# EAGLE design BikeLight_r10 (EAGLE 6.4)
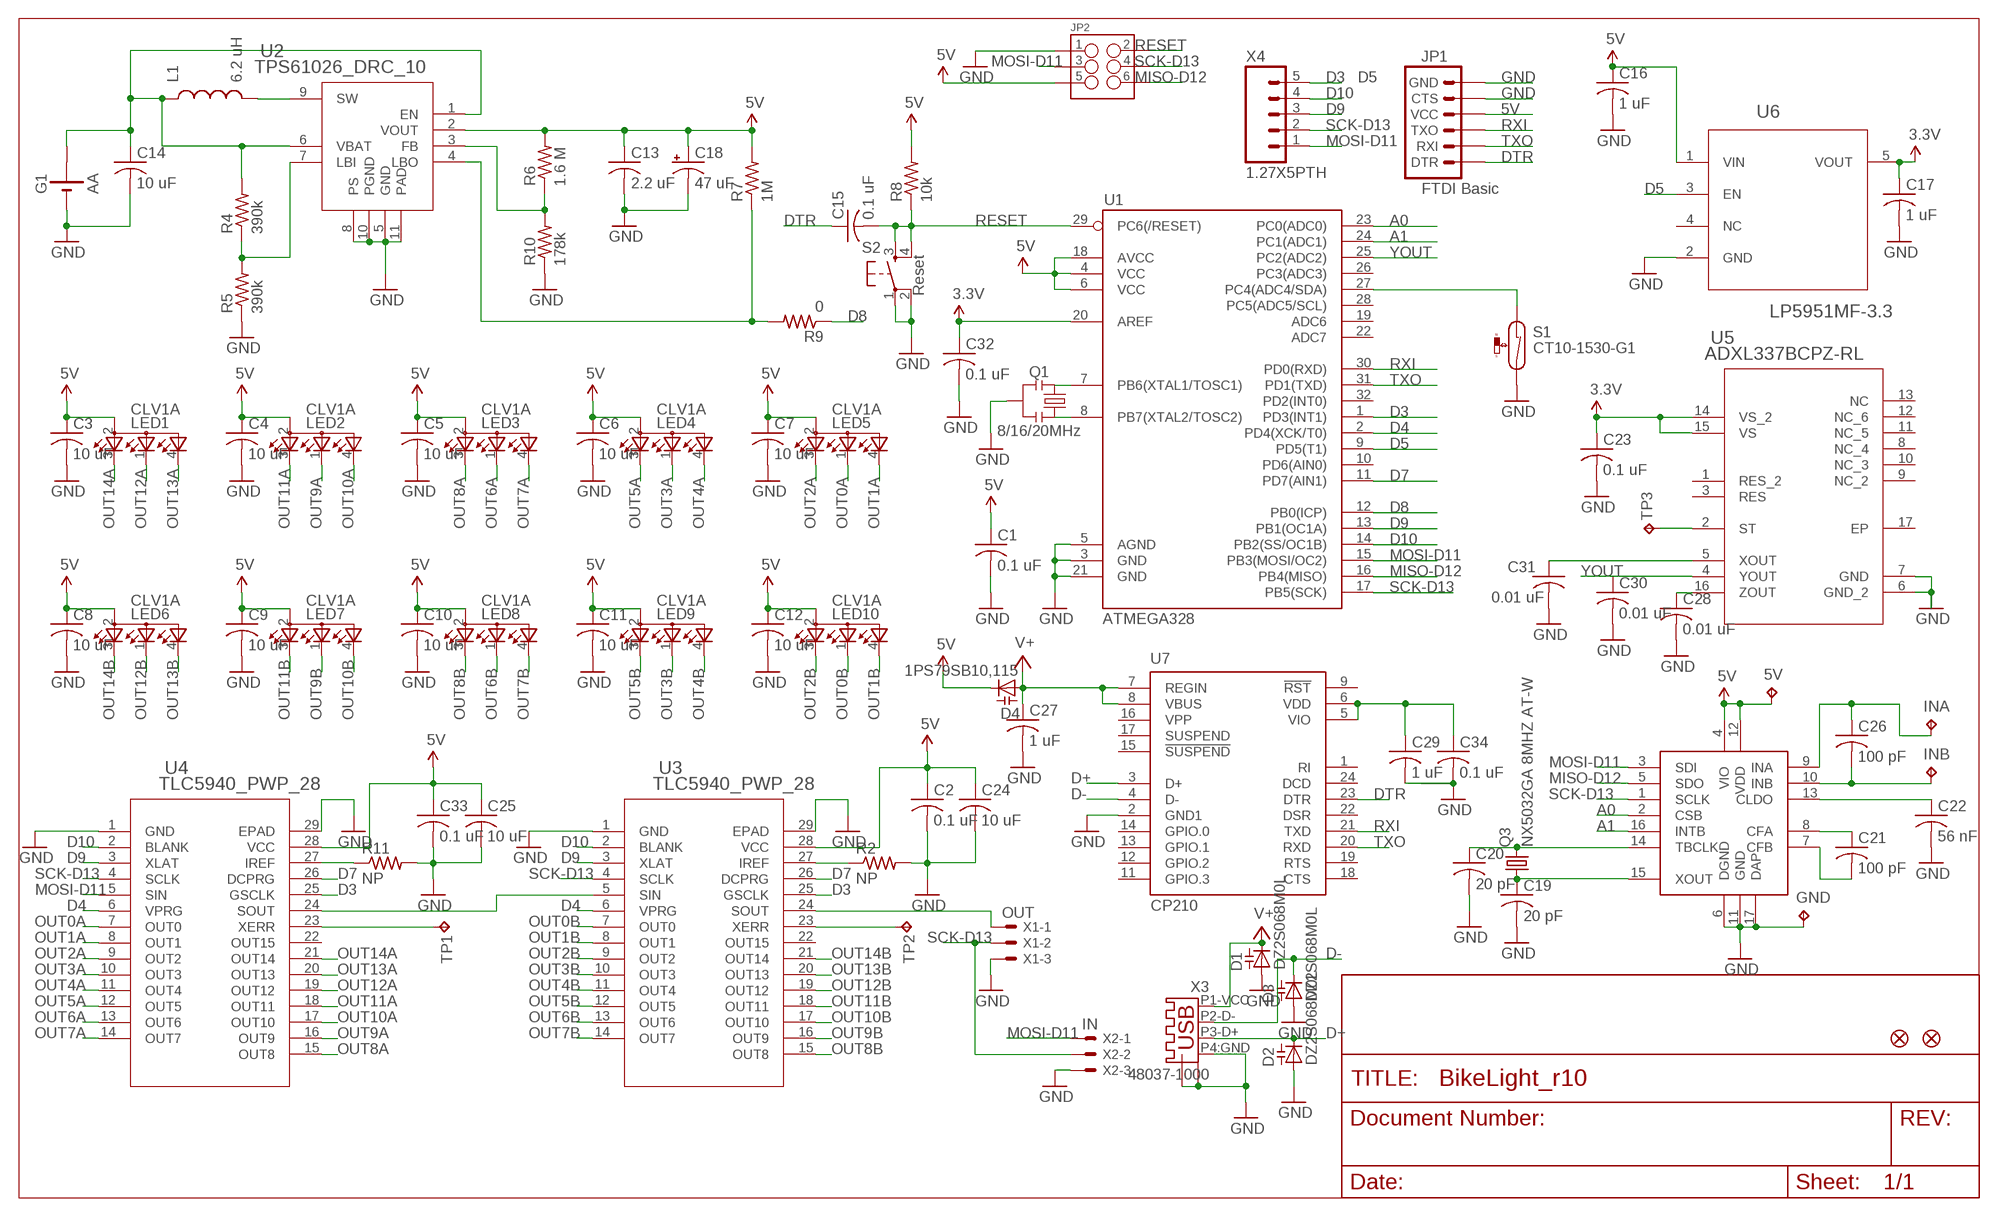
[diagram p0: schematic, sheet 1]

## Parts
5V  TPPAD1-13  [P1-13]
C1  0.1 uF  C-USC0402  [C0402]
C2  0.1 uF  C-USC0402  [C0402]
C3  10 uF  C-USC0805  [C0805]
C4  10 uF  C-USC0805  [C0805]
C5  10 uF  C-USC0805  [C0805]
C6  10 uF  C-USC0805  [C0805]
C7  10 uF  C-USC0805  [C0805]
C8  10 uF  C-USC0805  [C0805]
C9  10 uF  C-USC0805  [C0805]
C10  10 uF  C-USC0805  [C0805]
C11  10 uF  C-USC0805  [C0805]
C12  10 uF  C-USC0805  [C0805]
C13  2.2 uF  C-USC0805K  [C0805K]
C14  10 uF  C-USC0805K  [C0805K]
C15  0.1 uF  C-USC0402  [C0402]
C16  1 uF  C-USC0402  [C0402]
C17  1 uF  C-USC0402  [C0402]
C18  47 uF  CPOL-USCT6032  [CT6032]
C19  20 pF  C-USC0402  [C0402]
C20  20 pF  C-USC0402  [C0402]
C21  100 pF  C-USC0805K  [C0805K]
C22  56 nF  C-USC0402  [C0402]
C23  0.1 uF  C-USC0402  [C0402]
C24  10 uF  C-USC0805K  [C0805K]
C25  10 uF  C-USC0805K  [C0805K]
C26  100 pF  C-USC0805K  [C0805K]
C27  1 uF  C-USC0402  [C0402]
C28  0.01 uF  C-USC0402  [C0402]
C29  1 uF  C-USC0402  [C0402]
C30  0.01 uF  C-USC0402  [C0402]
C31  0.01 uF  C-USC0402  [C0402]
C32  0.1 uF  C-USC0402  [C0402]
C33  0.1 uF  C-USC0402  [C0402]
C34  0.1 uF  C-USC0402  [C0402]
D1  DZ2S068M0L  BB141  [SOD523]
D2  DZ2S068M0L  BB141  [SOD523]
D3  DZ2S068M0L  BB141  [SOD523]
D4  1PS79SB10,115  BB141  [SOD523]
G1  AA  [AA_BATTERY]
GND  TPPAD1-13  [P1-13]
INA  TPPAD1-13  [P1-13]
INB  TPPAD1-13  [P1-13]
JP1  FTDI Basic  ARDUINO_SERIAL_PROGRAMPTH  [1X06]
JP2  M03X2POGO_PINS  [2X3_POGO]
L1  6.2 uH  INDUCTORSRU1038  [CDRH52D]
LED1  CLV1A  TOPLED-3  [P-LCC-4-3]
LED2  CLV1A  TOPLED-3  [P-LCC-4-3]
LED3  CLV1A  TOPLED-3  [P-LCC-4-3]
LED4  CLV1A  TOPLED-3  [P-LCC-4-3]
LED5  CLV1A  TOPLED-3  [P-LCC-4-3]
LED6  CLV1A  TOPLED-3  [P-LCC-4-3]
LED7  CLV1A  TOPLED-3  [P-LCC-4-3]
LED8  CLV1A  TOPLED-3  [P-LCC-4-3]
LED9  CLV1A  TOPLED-3  [P-LCC-4-3]
LED10  CLV1A  TOPLED-3  [P-LCC-4-3]
Q1  8/16/20MHz  RESONATORSMD  [RESONATOR-SMD]
Q3  NX5032GA 8MHZ AT-W  FC-12M  [FC-12M]
R2  NP  R-US_R0402  [R0402]
R4  390k  R-US_R0402  [R0402]
R5  390k  R-US_R0402  [R0402]
R6  1.6 M  R-US_R0805  [R0805]
R7  1M  R-US_R0805  [R0805]
R8  10k  R-US_R0402  [R0402]
R9  0  R-US_R0805  [R0805]
R10  178k  R-US_R0805  [R0805]
R11  NP  R-US_R0402  [R0402]
S1  CT10-1530-G1  REED-SWITCH-CT10-1530-G1  [CT10-G1]
S2  Reset  TAC_SWITCHSMD  [TACTILE_SWITCH_SMD]
TP1  TPB1,27  [B1,27]
TP2  TPB1,27  [B1,27]
TP3  TPB1,27  [B1,27]
U1  ATMEGA328  ATMEGA168  [TQFP32-08]
U2  TPS61026_DRC_10  [DRC10_2P4X1P65]
U3  TLC5940_PWP_28  [PWP28_6P17X2P4]
U4  TLC5940_PWP_28  [PWP28_6P17X2P4]
U5  ADXL337BCPZ-RL  [CP_16_28]
U6  LP5951MF-3.3  [SOT95P285X120-5N]
U7  CP210  [QFN24-4X4]
U8  LDC1000  [WSON-16]
U$2  FIDUCIAL1X2  [FIDUCIAL-1X2]
U$4  FIDUCIAL1X2  [FIDUCIAL-1X2]
X1  OUT  22-23-2031  [22-23-2031]
X2  IN  22-23-2031  [22-23-2031]
X3  48037-1000  USB-A003  [USB-A_PLUG]
X4  1.27X5PTH  [1X04-1.27MM]

## Nets
3.3V: C17.1 C23.1 C32.1 U1.20(AREF) U5.14(VS_2) U5.15(VS) U6.5(VOUT)
5V: 5V.TP C1.1 C2.1 C3.1 C4.1 C5.1 C6.1 C7.1 C8.1 C9.1 C10.1 C11.1 C12.1 C13.1 C16.1 C18.+ C24.1 C25.1 C33.1 D4.C JP1.4(VCC) JP2.P$5 LED1.2(A2) LED2.2(A2) LED3.2(A2) LED4.2(A2) LED5.2(A2) LED6.2(A2) LED7.2(A2) LED8.2(A2) LED9.2(A2) LED10.2(A2) R6.2 R7.2 R8.2 U1.4(VCC) U1.6(VCC) U1.18(AVCC) U2.2(VOUT) U3.28(VCC) U4.28(VCC) U6.1(VIN) U8.4(VIO) U8.12(VDD)
A0: U1.23(PC0(ADC0)) U8.2(CSB)
A1: U1.24(PC1(ADC1)) U8.16(INTB)
D3: U1.1(PD3(INT1)) U3.25(GSCLK) U4.25(GSCLK) X4.5
D4: U1.2(PD4(XCK/T0)) U3.6(VPRG) U4.6(VPRG)
D5: U1.9(PD5(T1)) U6.3(EN)
D7: U1.11(PD7(AIN1)) U3.26(DCPRG) U4.26(DCPRG)
D8: R9.1 U1.12(PB0(ICP))
D9: U1.13(PB1(OC1A)) U3.3(XLAT) U4.3(XLAT) X4.3
D10: U1.14(PB2(SS/OC1B)) U3.2(BLANK) U4.2(BLANK) X4.4
D+: D2.C U7.3(D+) X3.P3-D+
D-: D3.C U7.4(D-) X3.P2-D-
DTR: C15.1 JP1.1(DTR) U7.23(DTR)
GND [vcc]: C1.2 C2.2 C3.2 C4.2 C5.2 C6.2 C7.2 C8.2 C9.2 C10.2 C11.2 C12.2 C13.2 C14.2 C16.2 C17.2 C18.- C19.2 C20.2 C22.2 C23.2 C24.2 C25.2 C27.2 C28.2 C29.2 C30.2 C31.2 C32.2 C33.2 C34.2 D1.A D2.A D3.A G1.P$2-(-) GND.TP JP1.5(CTS) JP1.6(GND) JP2.P$1 Q1.2 R2.2 R5.1 R10.1 R11.2 S1.2 S2.1 S2.2 U1.3(GND) U1.5(AGND) U1.21(GND) U2.5(GND) U2.8(PS) U2.10(PGND) U2.11(PAD) U3.1(GND) U3.29(EPAD) U4.1(GND) U4.29(EPAD) U5.6(GND_2) U5.7(GND) U6.2(GND) U7.2(GND1) U8.6(DGND) U8.11(GND) U8.17(DAP) X1.3 X2.3 X3.P4:GND X3.P$5(SHLD1) X3.P$6(SHLD2)
MISO-D12: JP2.P$6 U1.16(PB4(MISO)) U8.5(SDO)
MOSI-D11: JP2.P$3 U1.15(PB3(MOSI/OC2)) U4.5(SIN) U8.3(SDI) X2.1 X4.1
N$1: Q1.1 U1.8(PB7(XTAL2/TOSC2))
N$2: Q1.3 U1.7(PB6(XTAL1/TOSC1))
N$3: U3.5(SIN) U4.24(SOUT)
N$4: U3.24(SOUT) X1.1
N$5: TP1.TP U4.23(XERR)
N$6: TP2.TP U3.23(XERR)
N$7: R4.1 R5.2 U2.7(LBI)
N$8: R6.1 R10.2 U2.3(FB)
N$9: R2.1 U3.27(IREF)
N$10: C14.1 G1.P$1+(+) L1.1 R4.2 U2.1(EN) U2.6(VBAT)
N$11: L1.2 U2.9(SW)
N$12: R7.1 R9.2 U2.4(LBO)
N$13: TP3.TP U5.2(ST)
N$14: C20.1 Q3.2 U8.14(TBCLK)
N$15: C19.1 Q3.1 U8.15(XOUT)
N$16: R11.1 U4.27(IREF)
N$17: C21.1 U8.8(CFA)
N$18: C21.2 U8.7(CFB)
N$19: C26.2 INB.TP U8.10(INB)
N$20: C22.1 U8.13(CLDO)
N$21: C29.1 C34.1 U7.5(VIO) U7.6(VDD)
N$22: C26.1 INA.TP U8.9(INA)
N$23: C31.1 U5.5(XOUT)
N$25: S1.1 U1.27(PC4(ADC4/SDA))
OUT0A: LED5.1(CBLUE) U4.7(OUT0)
OUT0B: LED10.1(CBLUE) U3.7(OUT0)
OUT1A: LED5.4(CGREEN) U4.8(OUT1)
OUT1B: LED10.4(CGREEN) U3.8(OUT1)
OUT2A: LED5.3(CRED) U4.9(OUT2)
OUT2B: LED10.3(CRED) U3.9(OUT2)
OUT3A: LED4.1(CBLUE) U4.10(OUT3)
OUT3B: LED9.1(CBLUE) U3.10(OUT3)
OUT4A: LED4.4(CGREEN) U4.11(OUT4)
OUT4B: LED9.4(CGREEN) U3.11(OUT4)
OUT5A: LED4.3(CRED) U4.12(OUT5)
OUT5B: LED9.3(CRED) U3.12(OUT5)
OUT6A: LED3.1(CBLUE) U4.13(OUT6)
OUT6B: LED8.1(CBLUE) U3.13(OUT6)
OUT7A: LED3.4(CGREEN) U4.14(OUT7)
OUT7B: LED8.4(CGREEN) U3.14(OUT7)
OUT8A: LED3.3(CRED) U4.15(OUT8)
OUT8B: LED8.3(CRED) U3.15(OUT8)
OUT9A: LED2.1(CBLUE) U4.16(OUT9)
OUT9B: LED7.1(CBLUE) U3.16(OUT9)
OUT10A: LED2.4(CGREEN) U4.17(OUT10)
OUT10B: LED7.4(CGREEN) U3.17(OUT10)
OUT11A: LED2.3(CRED) U4.18(OUT11)
OUT11B: LED7.3(CRED) U3.18(OUT11)
OUT12A: LED1.1(CBLUE) U4.19(OUT12)
OUT12B: LED6.1(CBLUE) U3.19(OUT12)
OUT13A: LED1.4(CGREEN) U4.20(OUT13)
OUT13B: LED6.4(CGREEN) U3.20(OUT13)
OUT14A: LED1.3(CRED) U4.21(OUT14)
OUT14B: LED6.3(CRED) U3.21(OUT14)
RESET: C15.2 JP2.P$2 R8.1 S2.3 S2.4 U1.29(PC6(/RESET))
RXI: JP1.3(TXO) U1.30(PD0(RXD)) U7.21(TXD)
SCK-D13: JP2.P$4 U1.17(PB5(SCK)) U3.4(SCLK) U4.4(SCLK) U8.1(SCLK) X1.2 X2.2 X4.2
TXO: JP1.2(RXI) U1.31(PD1(TXD)) U7.20(RXD)
V+: C27.1 D1.C D4.A U7.7(REGIN) U7.8(VBUS) X3.P1-VCC
YOUT: C30.1 U1.25(PC2(ADC2)) U5.4(YOUT)
ZOUT: C28.1 U5.16(ZOUT)
Unconnected: U1.10(PD6(AIN0)) U1.19(ADC6) U1.22(ADC7) U1.26(PC3(ADC3)) U1.28(PC5(ADC5/SCL)) U1.32(PD2(INT0)) U3.22(OUT15) U4.22(OUT15) U5.1(RES_2) U5.3(RES) U5.8(NC_4) U5.9(NC_2) U5.10(NC_3) U5.11(NC_5) U5.12(NC_6) U5.13(NC) U5.17(EP) U6.4(NC) U7.1(RI) U7.9(!RST) U7.11(GPIO.3) U7.12(GPIO.2) U7.13(GPIO.1) U7.14(GPIO.0) U7.15(!SUSPEND) U7.16(VPP) U7.17(SUSPEND) U7.18(CTS) U7.19(RTS) U7.22(DSR) U7.24(DCD)

## Library data of the parts
5V GND INA INB TP1-TP3 = testpad:TP: Test pad
C1-C17 C19-C34 = resistor:C-US: CAPACITOR, American symbol
C18 = resistor:CPOL-US: POLARIZED CAPACITOR, American symbol
D1-D4 = diode:BB141: Capacity DIODE variable-capacitance diode
G1 = POV_light:AA: AA battery
JP1 = SparkFun:ARDUINO_SERIAL_PROGRAM
JP2 = 1.27mmx5 PTH:M03X2: 2x3 .1" header. Shrouded, with keying- CONN-10681 SMT- CONN-11415 Pogo pins- HW-11044; PROD_ID: HW-11044
L1 = Inductor-SumidaCDRH5D28:INDUCTOR: Inductors Basic Inductor/Choke - 0603 and 1206. Footprints are not proven and vary greatly between part numbers.
LED1-LED10 = ledengin:TOPLED-3: OSRAM - Hyper Multi TOPLED® (RGB) LB E673, LV E673, LT E673 - Power TOPLED® Enhanced optical Power LED (HOP2000) LS E67B, LA E67B, LO E67B, LY E67B - Hyper Multi TOPLED® Enhanced optical Power LED (HOP2000 / ATON®) LATB T66B - Hyper Multi TOPLED® Hyper-Bright LED LATB T686 Source: http://www.osram.convergy.de/
Q1 = SparkFun:RESONATOR: Resonator Small SMD resonator. This is the itty bitty 10/20MHz resonators with built in caps. CSTCE10M0G55 and CSTCE20M0V53. Footprint has been reviewed closely but hasn't been tested yet.
Q3 = crystal:FC-12M: kHz RANGE CRYSTAL UNIT LOW PROFILE SMD Source: Epson Toyocom FC-12M.pdf
R2 R4-R9 R11 = resistor:R-US_: RESISTOR, American symbol
R10 = adafruit:R-US_: RESISTOR, American symbol
S1 = switch-reed:REED-SWITCH-: Reed Sensor; MF: COTO TECHNOLOGY; MPN: CT10-1530-G1; OC_FARNELL: 1081696
S2 = SparkFun:TAC_SWITCH: Momentary Switch Button commonly used for reset or general input. Spark Fun Electronics SKU : COM-00097
U1 = SparkFun:ATMEGA168
U2 = TPS61026:TPS61026_DRC_10; DATASHEETURL: http://www.ti.com/lit/gpn/TPS61026; DESCRIPTION: 5.0-V Output, 1.8-A Switch, 96% Efficient Boost Converter w/ LDO Down-Mode, QFN-10; FAMILY_NAME: STEP-UP REGULATOR; GENERIC_PART_NUMBER: TPS61026; INDUSTRY_STD_PKG_TYPE: SON; MANUFACTURER: Texas Instruments; MANUFACTURER_PART_NUMBER: tps61026_drc_10; PACKAGE_DESIGNATOR: DRC; PIN_COUNT: 10; VENDOR: Texas Instruments
U3 U4 = TI:TLC5940_PWP_28; DATASHEETURL: http://www.ti.com/lit/gpn/TLC5940; DESCRIPTION: 16-Channel LED Driver w/EEprom DOT Correction & Grayscale PWM Control; FAMILY_NAME: LED DRIVER; GENERIC_PART_NUMBER: TLC5940; INDUSTRY_STD_PKG_TYPE: HTSSOP; MANUFACTURER: Texas Instruments; MANUFACTURER_PART_NUMBER: tlc5940_pwp_28; PACKAGE_DESIGNATOR: PWP; PIN_COUNT: 28; VENDOR: Texas Instruments
U5 = ADXL337:ADXL337BCPZ-RL
U6 = LP5951:LP5951MF-3.3: Low-Dropout CMOS Voltage Regulator; MPN: LP5951MF-33; OC_FARNELL: 1312658; OC_NEWARK: 13M2085; PACKAGE: SOT-23-5; SUPPLIER: National Semiconductors
U7 = POV_light:CP210*: Single-Chip USB to UART Bridge Source: www.silabs.com .. CP2101.pdf / cp2102.pdf
U8 = LDC1000:LDC1000
U$2 U$4 = SparkFun:FIDUCIAL: Fiducial Alignment Points Various fiducial points for machine vision alignment.
X1 X2 = con-molex:22-23-2031: .100" (2.54mm) Center Header - 3 Pin; MF: MOLEX; MPN: 22-23-2031; OC_FARNELL: 1462950; OC_NEWARK: 30C0862
X3 = POV_light:USB-A003: USB connector
X4 = 1.27mmx5 PTH:1.27X5PTH

## Net classes
0 default: width 0.203 mm
1 vcc: width 0.254 mm

## Board
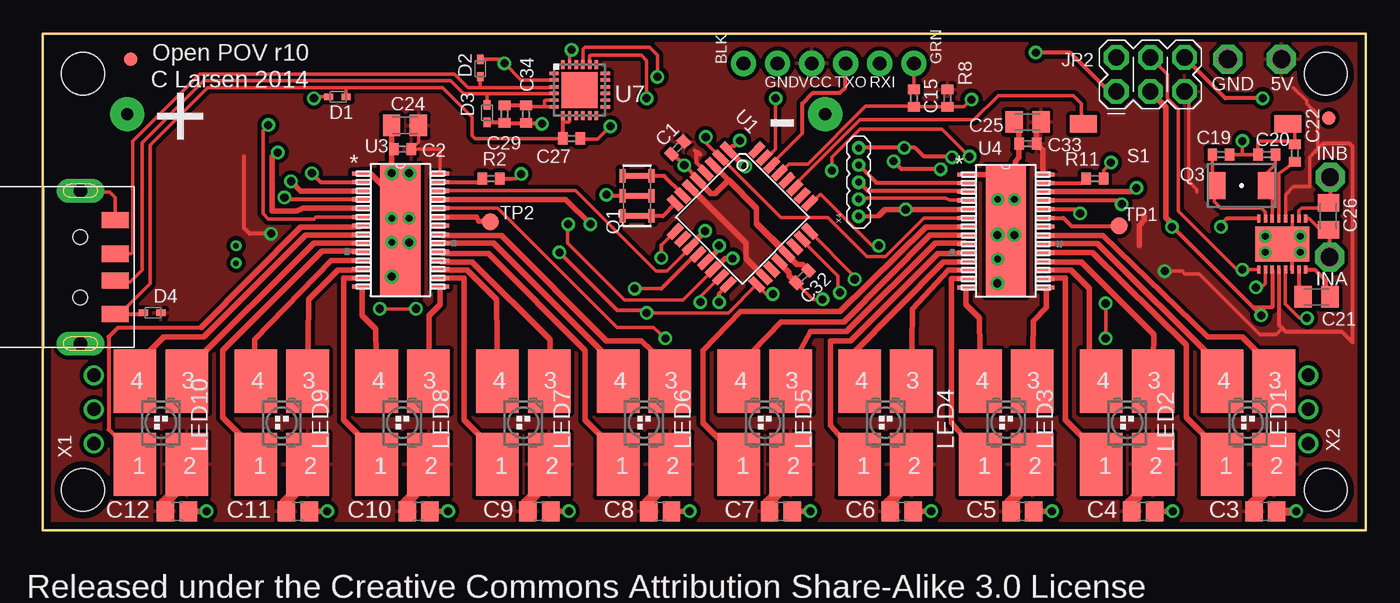
[diagram p1: board, top side]
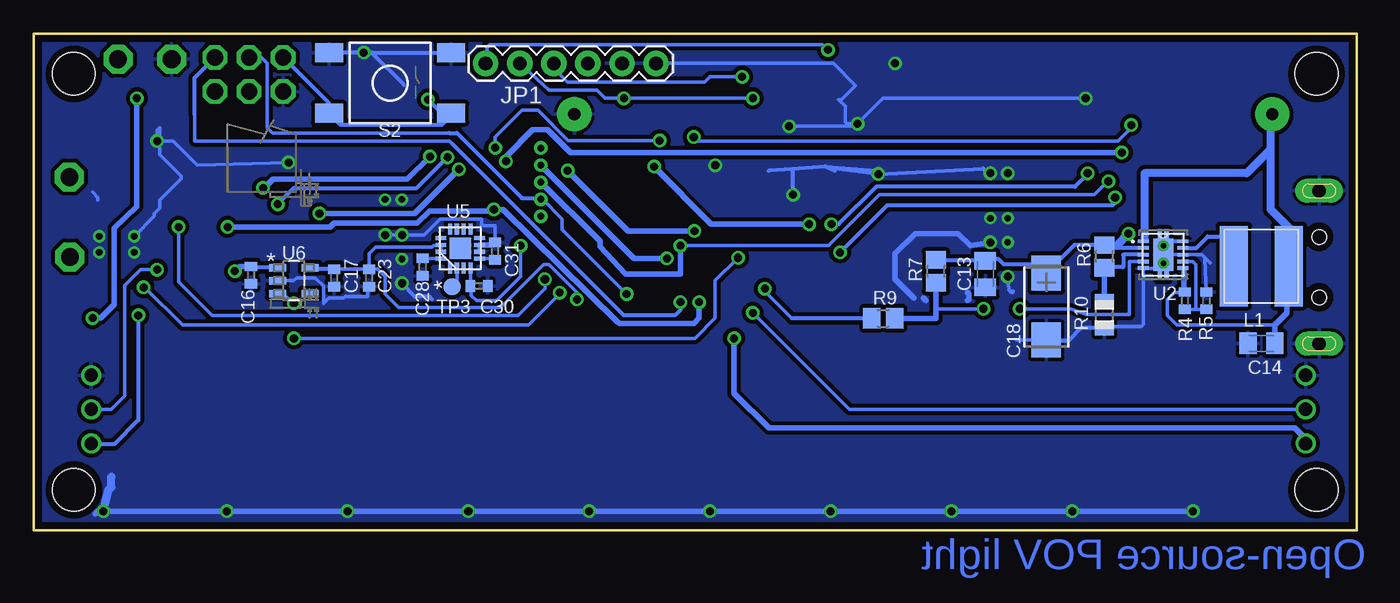
[diagram p2: board, bottom side, seen from below]

Size 98.6 x 37.02 mm. Coordinates in mm from the lower left corner, seen from the top.
Outline: 0,37.02 0,0 98.6,0 98.6,37.02 0,37.02
Copper layers (1*16): Top 0.0178mm / dielectric 59mil / Bottom 0.0178mm
Design rules "SSC-EAGLE-2Lyr_v1.0.0.3": minimum track width 6mil, minimum drill 14mil, track to track 6mil, track to pad 6mil, pad to pad 6mil, via to via 6mil, smd to smd 6mil, copper to edge 20mil, drill to drill 16mil, minimum pad ring 8mil, minimum via ring 8mil, stop-mask expansion 3mil, vias tented up to drill 0mil, thermal gap 10mil
Holes 3.2 mm at 3,3 95.6,3 95.6,34.02 3,34.02

### Footprints (pad centres in the part's own frame; a part is rotated, then mirrored left to right if it is on the bottom)
P1-13 = drill 1.321 pad 2.159 octagon: TP 0,0
C0402 = smd 0.7 x 0.9: 1 -0.65,0; 2 0.65,0
C0805 = smd 1.3 x 1.5: 1 -0.85,0; 2 0.85,0
C0805K = smd 1.3 x 1.6: 1 -1,0; 2 1,0
CT6032 = smd 2.6 x 2.2: + 2.5,0; - -2.5,0
SOD523 = smd 0.7 x 0.5: A 0.7,0; C -0.6,0
AA_BATTERY = drill 0.9 pad 2.54: P$1+ -26,0; P$2- 26,0
1X06 = drill 1.016 pad 1.88: 1 0,0; 2 2.54,0; 3 5.08,0; 4 7.62,0; 5 10.16,0; 6 12.7,0
2X3_POGO = drill 1.2 pad 1.829 octagon: P$1 0,0; P$2 0,2.54; P$3 2.54,0; P$4 2.54,2.54; P$5 5.08,0; P$6 5.08,2.54
CDRH52D = smd 2.1 x 6: 1 -2.05,0; 2 2.05,0
P-LCC-4-3 = smd 3.175 x 4.699: 1 1.93,3.099; 2 -1.93,3.099; 3 -1.93,-3.099; 4 1.93,-3.099
RESONATOR-SMD = smd 0.4 x 1.7: 1 -1.5,0; 2 0,0; 3 1.5,0 | smd 1 x 0.45: P$1 0,1.074; P$2 1.5,1.074; P$3 -1.5,1.074; P$4 1.5,-1.074; P$5 0,-1.074; P$6 -1.5,-1.074
FC-12M = smd 1.3 x 2: 1 -1.85,0; 2 1.85,0
R0402 = smd 0.7 x 0.9: 1 -0.65,0; 2 0.65,0
R0805 = smd 1.3 x 1.5: 1 -0.85,0; 2 0.85,0
R0805' = smd 1.1 x 1.4: 1 -1,0; 2 1,0
CT10-G1 = smd 2 x 1.3: 1 -7.62,0; 2 7.62,0
TACTILE_SWITCH_SMD = smd 2.1 x 1.4: 1 -4.55,2.25; 2 4.55,2.25; 3 -4.55,-2.25; 4 4.55,-2.25
B1,27 = smd 1.27 x 1.27: TP 0,0
TQFP32-08 = smd 1.27 x 0.559: 1 -4.293,2.8; 2 -4.293,2; 3 -4.293,1.2; 4 -4.293,0.4; 5 -4.293,-0.4; 6 -4.293,-1.2; 7 -4.293,-2; 8 -4.293,-2.8; 17 4.293,-2.8; 18 4.293,-2; 19 4.293,-1.2; 20 4.293,-0.4; 21 4.293,0.4; 22 4.293,1.2; 23 4.293,2; 24 4.293,2.8 | smd 0.559 x 1.27: 9 -2.8,-4.293; 10 -2,-4.293; 11 -1.2,-4.293; 12 -0.4,-4.293; 13 0.4,-4.293; 14 1.2,-4.293; 15 2,-4.293; 16 2.8,-4.293; 25 2.8,4.293; 26 2,4.293; 27 1.2,4.293; 28 0.4,4.293; 29 -0.4,4.293; 30 -1.2,4.293; 31 -2,4.293; 32 -2.8,4.293
DRC10_2P4X1P65 = smd 0.838 x 0.279: 1 -1.473,0.991; 2 -1.473,0.508; 3 -1.473,0; 4 -1.473,-0.508; 5 -1.473,-0.991; 6 1.473,-0.991; 7 1.473,-0.508; 8 1.473,0; 9 1.473,0.508; 10 1.473,0.991 | smd 1.5 x 2.4: 11 0,0 | smd 0.3 x 0.7: P$1 -0.254,-1.549; P$2 0.254,-1.549; P$3 0.254,1.549; P$4 -0.254,1.549
PWP28_6P17X2P4 = smd 1.27 x 0.305: 1 -2.972,4.216; 2 -2.972,3.581; 3 -2.972,2.921; 4 -2.972,2.286; 5 -2.972,1.626; 6 -2.972,0.965; 7 -2.972,0.33; 8 -2.972,-0.33; 9 -2.972,-0.965; 10 -2.972,-1.626; 11 -2.972,-2.286; 12 -2.972,-2.921; 13 -2.972,-3.581; 14 -2.972,-4.216; 15 2.972,-4.216; 16 2.972,-3.581; 17 2.972,-2.921; 18 2.972,-2.286; 19 2.972,-1.626; 20 2.972,-0.965; 21 2.972,-0.33; 22 2.972,0.33; 23 2.972,0.965; 24 2.972,1.626; 25 2.972,2.286; 26 2.972,2.921; 27 2.972,3.581; 28 2.972,4.216 | smd 3 x 9.7: 29 0,0
CP_16_28 = smd 0.813 x 0.305: 1 -1.448,0.762; 2 -1.448,0.254; 3 -1.448,-0.254; 4 -1.448,-0.762; 9 1.448,-0.762; 10 1.448,-0.254; 11 1.448,0.254; 12 1.448,0.762 | smd 0.305 x 0.813: 5 -0.762,-1.448; 6 -0.254,-1.448; 7 0.254,-1.448; 8 0.762,-1.448; 13 0.762,1.448; 14 0.254,1.448; 15 -0.254,1.448; 16 -0.762,1.448 | smd 1.6 x 1.6: 17 0,0
SOT95P285X120-5N = smd 1.27 x 0.559: 1 -1.219,0.965; 2 -1.219,0; 3 -1.219,-0.965; 4 1.219,-0.965; 5 1.219,0.965
QFN24-4X4 = smd 0.7 x 0.25: 1 -1.9,1.25; 2 -1.9,0.75; 3 -1.9,0.25; 4 -1.9,-0.25; 5 -1.9,-0.75; 6 -1.9,-1.25; 13 1.9,-1.25; 14 1.9,-0.75; 15 1.9,-0.25; 16 1.9,0.25; 17 1.9,0.75; 18 1.9,1.25 | smd 0.25 x 0.7: 7 -1.25,-1.9; 8 -0.75,-1.9; 9 -0.25,-1.9; 10 0.25,-1.9; 11 0.75,-1.9; 12 1.25,-1.9; 19 1.25,1.9; 20 0.75,1.9; 21 0.25,1.9; 22 -0.25,1.9; 23 -0.75,1.9; 24 -1.25,1.9 | smd 2.7 x 2.7: EXP 0,0
WSON-16 = smd 0.25 x 0.6: 1 -1.75,-1.9; 2 -1.25,-1.9; 3 -0.75,-1.9; 4 -0.25,-1.9; 5 0.25,-1.9; 6 0.75,-1.9; 7 1.25,-1.9; 8 1.75,-1.9; 9 1.75,1.9; 10 1.25,1.9; 11 0.75,1.9; 12 0.25,1.9; 13 -0.25,1.9; 14 -0.75,1.9; 15 -1.25,1.9; 16 -1.75,1.9 | smd 4 x 2.6: 17 0,0
FIDUCIAL-1X2 = smd 1 x 1: 1 0,0
22-23-2031 = drill 1: 1 -2.54,0; 2 0,0; 3 2.54,0
USB-A_PLUG = smd 1.2 x 2: P1-VCC 3.5,2.6; P2-D- 1,2.6; P3-D+ -1,2.6; P4:GND -3.5,2.6 | drill 1 pad 1.778 long: P$5 -5.7,0; P$6 5.7,0 | hole 1.1: -2.25,0; 2.25,0
1X04-1.27MM = drill 0.508 pad 1: 1 0,0; 2 1.27,0; 3 2.54,0; 4 3.81,0; 5 5.08,0

### Placement (x,y rotation side)
5V  92.3,35.1 0 top
C1  47.3,28.5 225 top
C2  26.8,28.4 180 top
C3  91.1,1.4 0 top
C4  82,1.4 0 top
C5  73,1.4 0 top
C6  64,1.4 0 top
C7  55,1.4 0 top
C8  46,1.4 0 top
C9  37,1.4 0 top
C10  28,1.4 0 top
C11  19,1.4 0 top
C12  10,1.4 0 top
C13  27.68,19.09 270 bottom
C14  7.1,13.92 180 bottom
C15  64.9,32.2 270 top
C16  82.4,19 270 bottom
C17  76.2,18.8 270 bottom
C18  23.13,16.66 90 bottom
C19  87.8,28 0 top
C20  91.2,28 180 top
C21  94.92,17.38 180 top
C22  93.3,28.1 90 top
C23  73.6,18.8 270 bottom
C24  26.99,30.17 180 top
C25  73.38,30.42 180 top
C26  95.8,23.4 90 top
C27  39.4,29.2 0 top
C28  69.6,19.6 270 bottom
C29  34.4,31 270 top
C30  65.4,18.2 0 bottom
C31  64.2,20.8 90 bottom
C32  56.6,18.9 45 top
C33  73.4,28.8 180 top
C34  36,31 270 top
D1  22,32.3 180 top
D2  32.6,34.4 90 top
D3  33.1,31.1 270 top
D4  8.2,16.2 180 top
G1  32.3,31 0 top
GND  88.3,35.1 0 top
INA  95.89,20.36 0 top
INB  95.93,26.32 0 top
JP1  64.91,34.79 0 bottom
JP2  80,32.7 0 top
L1  7.11,19.67 180 bottom
LED1  89.8,8 180 top
LED2  80.8,8 180 top
LED3  71.8,8 180 top
LED4  62.8,8 180 top
LED5  53.8,8 180 top
LED6  44.8,8 180 top
LED7  35.8,8 180 top
LED8  26.8,8 180 top
LED9  17.8,8 180 top
LED10  8.8,8 180 top
Q1  44.27,24.92 90 top
Q3  89.33,25.69 0 top
R2  33.4,26.2 0 top
R4  12.8,17.1 90 bottom
R5  11.2,17.1 270 bottom
R6  18.8,20.4 90 bottom
R7  31.35,19.29 90 bottom
R8  67.4,32.2 90 top
R9  35.29,15.79 0 bottom
R10  178k  [R0805']  18.8,16.05 90 bottom
R11  78.4,26.2 0 top
S1  85.16,30.28 0 top
S2  72.03,33.33 0 bottom
TP1  80.2,22.67 0 top
TP2  33.33,22.99 0 top
TP3  67.41,18.14 0 bottom
U1  52.14,23.32 315 top
U2  14.42,20.53 0 bottom
U3  26.65,22.37 0 top
U4  71.76,22.3 0 top
U5  66.8,21 90 bottom
U6  79.2,18.6 0 bottom
U7  40,32.8 0 top
U8  92.36,21.32 0 top
U$2  95.82,30.72 0 top
U$4  6.56,35.11 0 top
X1  3.8,9 90 top
X2  94.3,9 90 top
X3  2.8,19.6 270 top
X4  60.8,23.4 90 top

### Tracks (layer width: path | path; a pad name or v marks a point on that pad's centre or on a via)
3.3V  (via drill 0.6)
  Top 0.254: v58.1,17.2 57.38,17.2 C32.1
  Top 0.406: 55.01,20 U1.20 54.89,19.91 55.6,19.2 55.6,18.98 C32.1
  Bottom 0.254: U5.15 U5.14 68.3,21.2 68.8,21.2 68.9,21.1 73.1,21.1 73.6,20.6 C23.1 | 58.1,17.6 v58.1,17.2 58.1,17.7 60.2,19.8 60.6,19.8 63.8,16.6 71.4,16.6 72.4,17.6 72.4,18.9 72.95,19.45 C23.1 | C17.1 C23.1
  Bottom 0.305: C17.1 77.87,19.45 U6.5
5V  (via drill 0.6)
  Top 0.203: 29.28,26.67 U3.28
  Top 0.254: 86,25.2 86,25.4 85.4,26 85.4,32.38 JP2.P$5 | U8.12 92.61,25.01 93.2,25.6 94.4,25.6 94.4,27.8 94.8,28.2 95,28.4 95,31 94.2,31.8 94.2,32 93.2,33 | 93.2,35 5V.TP | C24.1 27.99,28.94 C2.1 29.62,28.4 U3.28 | v83.6,19.3 84.9,19.3 85.1,19.1 86.2,19.1 90.7,14.6 91.9,14.6 92.35,15.05
  Top 0.305: U1.4 49.39,26.71 48.7,27.4 48.7,28.2 | 48.7,28.2 48.6,28.3 | 48.7,28.2 48.8,28.2 49,28 48.8,28 | U8.4 92.11,15.29 92.35,15.05 92.6,14.8 96.8,14.8 97.6,14 97.6,28.6 97.4,28.8 95.4,28.8 94.8,28.2 | v17,22.1 15.4,22.1 15,22.5 15,27.86
  Top 0.406: 74.52,30.28 C25.1 74.05,30.09 C33.1 | U1.6 48.29,25.51 52.4,21.4 52.4,20.23 U1.18 | 81.7,21.2 81.7,22.7 82.1,23.1 82.1,23.4 82,23.5 | 10.3,4 10.8,4 LED10.2 | 19.3,5 19.8,5 LED9.2 | 28.3,4 28.8,4 LED8.2 | 37.3,4.5 37.8,4.5 LED7.2 | 46.3,4.5 46.8,4.5 LED6.2 | 55.3,4.5 55.8,4.5 LED5.2 | 64.3,5 64.8,5 LED4.2 | 73.3,4.5 73.8,4.5 LED3.2 | LED2.2 82.8,5 81.6,5 | 74.15,28.7 C33.1 | 74.52,26.73 74.52,28.33 C33.1 | 81.6,1.6 81.15,1.6 C4.1
  Top 0.813: 10.3,4 10.3,3.3 9,2 9,1.55 C12.1 | 19.3,5 19.3,3.3 18,2 18,1.55 C11.1 | 28.3,4 28.3,3.3 27,2 27,1.55 C10.1 | 37.3,4.5 37.3,3.3 36,2 36,1.55 C9.1 | 46.3,4.5 46.3,3.3 45,2 45,1.55 C8.1 | 55.3,4.5 55.3,3.3 54,2 54,1.55 C7.1 | 64.3,5 64.3,3.3 63,2 63,1.55 C6.1 | 73.3,4.5 73.3,3.3 72,2 72,1.55 C5.1 | 81.6,5 81.6,2.6 81,2 81,1.55 C4.1 | LED1.2 91.73,3.53 90.2,2 90.2,1.45 C3.1
  Bottom 0.203: 18.3,21.26 19.12,21.26 R6.2
  Bottom 0.305: U2.2 18.08,21.04 18.3,21.26 | 17.84,21.26 19.12,21.26 21.03,21.26 C18.+ | U6.1 82.31,19.57 C16.1 | 23.3,19.7 23.9,19.7 24,19.8 26.3,19.8 26.7,20.2 27.65,20.2 C13.1 | 27.61,19.8 C13.1 | 31.26,20.23 R7.2 | 31.2,20.29 R7.2 | C13.1 31.3,20.09 R7.2
  Bottom 0.406: C18.+ 23.3,19.16 23.3,19.7 | 27.68,19.7 C13.1 | 31.35,19.73 R7.2 | C16.1 83.25,19.65 v83.6,19.3
  Bottom 0.61: 17.84,21.26 v17,22.1
  pour Top (isolate 0.305): 0,37.02 98.6,37.02 98.6,0 0,0
A0  (via drill 0.6)
  Top 0.254: U8.2 91.1,18.4 90.8,18.1 v90.4,18.1 | v59.4,17.7 59.25,17.75 59.25,18.95 56.59,21.61
  Top 0.305: U8.2
  Top 0.406: 56.59,21.61 U1.23
  Bottom 0.254: v90.4,18.1 90.3,18.1 87.5,15.3 61.7,15.3 59.4,17.6 v59.4,17.7
A1  (via drill 0.6)
  Top 0.254: v87.8,22.6 87.8,22.81 88.2,23.21 | v60.5,18.7 60.5,18.92 U1.24
  Top 0.305: U8.16 88.2,23.21
  Bottom 0.254: v87.8,22.6 87.8,18.5 85.3,16 62.5,16 60.5,18 v60.5,18.7
D3  (via drill 0.6)
  Top 0.305: U4.25 80.11,24.59 v80.4,24.3 | U1.1 51.4,28.65 51.55,28.65 v51.95,29.05 | v67.75,27.8 67.75,27.85 65.65,27.85 65,28.5 v64.2,28.5 60.82,28.5 X4.5
  Top 0.406: U3.25 38.94,24.66 v40.8,22.8 | v52.35,27.1 52.22,27.2 U1.1
  Bottom 0.254: v51.95,29.05 58.75,29.05 61,31.3 62.2,31.3 64.2,29.3 v64.2,28.5
  Bottom 0.305: v67.75,27.8 70.05,25.5 79.2,25.5 v80.4,24.3
  Bottom 0.406: v40.8,22.8 48.1,22.8 v52.35,27.1
D4  (via drill 0.6)
  Top 0.254: U4.6 65.67,23.27 62.8,20.4 61.4,20.4 58.5,23.3 55.02,23.3 U1.2 | U3.6 20.34,23.34 20.2,23.2 16.8,23.2 16.4,23.6 16.4,29.8 v16.8,30.2 | U1.2 50.43,27.77 | v49.4,29.3 49.4,28.89 U1.2
  Bottom 0.254: v16.8,30.2 16.8,30 17.8,29 49.2,29 49.2,29.1 v49.4,29.3
D5  (via drill 0.6)
  Top 0.254: v79.2,16.9 v79.2,14.3 | 46.1,21.24 U1.9
  Top 0.305: v46.1,20.3 46.1,21.24
  Bottom 0.254: v79.2,14.3 49.3,14.3 47.8,15.8 47.8,18.6 v46.1,20.3 | U6.3 80.03,17.64 v79.2,16.9
D7  (via drill 0.6)
  Top 0.254: 29.71,25.3 39.7,25.3 45.7,19.3 46.5,19.3 48.26,21.06 | v69.05,27.85 67,29.9 60.9,29.9 58.8,27.8 58.8,26.85
  Top 0.406: U3.26 29.71,25.3 | 48.26,21.06 U1.11 48.26,21.21 v49.35,22.3 | U4.26 81.22,25.22 v81.5,25.5 | v58.8,26.8 58.8,26.85
  Bottom 0.406: v81.5,25.5 81.4,25.5 80.75,26.15 70.75,26.15 v69.05,27.85 | v49.35,22.3 54.3,22.3 v58.8,26.8
D8  (via drill 0.6)
  Top 0.254: 46.1,18 v44.1,18
  Top 0.305: U1.12 48.67,20.57 46.1,18
  Bottom 0.254: v44.1,18 44.1,17.79 42.1,15.79
  Bottom 0.305: R9.1 42.1,15.79
D9  (via drill 0.6)
  Top 0.305: 68.71,25.3 61.44,25.3 X4.3
  Top 0.406: U1.13 49.45,20 50.35,20.9 v50.4,21.2 | 68.71,25.3 U4.3 | U3.3 19.21,25.29 v18.5,26
  Bottom 0.254: 18.55,26 19.55,25 35.55,25 39.35,21.2 v50.4,21.2
  Bottom 0.406: v50.4,21.2 50.4,19.1 54.5,19.1 56.4,21.15 56.4,21.54 X4.3 | v18.5,26 18.55,26
D10  (via drill 0.6)
  Top 0.254: 49.95,19.4 47.7,17.15 43.35,17.15 39.1,21.4 39.1,22.75 v39.15,22.8 39.15,22.5
  Top 0.305: U3.2 20.7,25.95 v20.05,26.6 | 68.67,25.9 62.11,25.9 X4.4
  Top 0.406: 49.95,19.4 U1.14 50.04,19.44 50.85,20.25 v51.4,20.25 | U3.2 | 68.67,25.9 U4.2
  Bottom 0.305: v39.15,22.8 38.6,22.8 35.8,25.6 21,25.6 20.05,26.55 v20.05,26.6
  Bottom 0.406: v51.4,20.25 53.84,20.25 X4.4
D+
  Top 0.254: X3.P3-D+ 6.6,20.6 6.7,20.7 6.7,29 11.7,34 30.7,34 31.7,33 32.6,33 | 32.6,33 38.05,33 U7.3 | D2.C 32.6,33
D-
  Top 0.254: U7.4 33.1,32.55 | 33.1,32.55 31.35,32.55 30.4,33.5 12,33.5 7.4,28.9 7.4,19.4 6.5,18.5 5.5,18.5 X3.P2-D- | D3.C 33.1,32.55
DTR  (via drill 0.6)
  Top 0.203: 64.89,34.29 64.84,34.29 JP1.1
  Top 0.254: C15.1 64.9,34.98 JP1.1 | U7.23 39.25,35.65 v39.4,35.8
  Bottom 0.254: v39.4,35.8 39.8,36.2 64.6,36.2 64.8,36 64.8,34.9 JP1.1
GND  (via drill 0.4, 0.5, 0.6)
  Top 0.254: U8.11 93.11,22.07 | 26.8,22.86 26.74,22.86 U3.29 | v71.15,18.4 71.2,19.9 71.9,20.6 | 89.4,28 v89.4,29 | X3.P4:GND 5.4,24.8 5,25.2 2.9,25.2 X3.P$5 | 37.65,33.55 U7.2 35.65,33.55 v34.4,34.8 34.1,35.1 D2.A | R11.2 79.05,26.85 v79.6,27.4 | 26.6,20.4 26.6,19.6 v26,18.9 | v71.15,22 71.46,22 U4.29 | C19.2 89.4,28 | C20.2 89.4,28 | 90.4,28.15 C20.2 | 36.95,30.35 v37.2,30.3 | 34.35,30.4 C29.2 | C20.2 90.55,28.85 90.7,29 93.2,29 | 93.2,29 93.35,29 C22.2 | C22.2 93.2,29 | 92.92,30.48 93.3,30.1 | 93.2,30.06 S1.2 | C22.2 93.3,29.9 93.4,30 | D1.A 20.4,32.3 v20.2,32.2 | 34.9,26.2 35.3,26.2 v35.65,26.55 | 40,29.15 41.35,29.15 v42.3,30.1
  Top 0.305: U8.6 93.11,21.49 | U1.5 48.82,26.18 v47.8,27.2 46.96,28.04 C1.2 | R2.2 34.9,26.2 | JP2.P$1 79.46,32.7 S2.1 74.02,35.58 v74,35.6 | 72.35,22.41 71.76,23 | v27.3,26.6 27.25,26.6 26.65,26 | 36.95,30.35 C34.2 C29.2 | D3.A 34.35,30.4 | 40,29.15 C27.2 | 93.4,30 93.4,30.3 93.22,30.48 92.92,30.48 S1.2 | Q1.2 42.08,24.92 v42,25
  Top 0.406: U3.1 24.41,26.59 26.8,24.2 26.8,22.86 26.8,22 26.6,21.8 | U3.29 26.65,26 | 72.4,30.2 72.38,30.22 C25.2 72.75,30.05 C33.2 72.75,27.76 72.46,27.47 72.46,26.52 | 93.11,21.49 93,21.6 92.64,21.6 U8.17 93.11,22.07 91.1,22.07 v91.1,20.7 | 55.46,20.54 U1.21 55.46,20.64 53.2,22.9 53.2,23.96 51.08,26.08 | 51.08,26.08 U1.3 | U1.5 49.8,25.1 50.1,25.1 51.08,26.08 | 51.08,26.08 51.12,26.08 53.2,24 53.2,22.8 55.46,20.54 | U4.1 72.46,26.52 | 72.46,26.52 72.46,23 U4.29 | U4.29 71.76,20.74 71.9,20.6 72.3,20.2 | U4.29 71.76,23 71.76,24.65 v72.4,24.65 v71.15,24.65 | 26.6,21.8 26,21.8 v26,23.25 v26,21.45 | 55.46,20.54 56.2,19.8 56.62,19.8 C32.2 | 26.6,21.8 26.6,20.4 v27.3,21.45 | C12.2 v12.2,1.4 | C11.2 v21.2,1.4 | C10.2 v30.2,1.4 | C9.2 v39.2,1.4 | C8.2 v48.2,1.4 | C7.2 v57.2,1.4 | C6.2 v66.2,1.4 | C5.2 v75.2,1.4 | C4.2 v84.2,1.4 | v26,26.6 26,28.4 C2.2 25.99,28.4 C24.2
  Top 0.61: C3.2 v93.4,1.4
  Bottom 0.254: 18.77,15.17 16.04,15.17 15.89,15.32 U2.5 15.85,19.5 14.93,19.5 14.42,20.01 U2.11 U2.8 11.53,20.53 11.25,20.25 | U6.2 79.2,18.6 79,18.8 77.6,18.8 77,18.2 77,16.9 76.6,17.3 75.5,17.3 75.35,17.45 75.35,17.4 73.7,17.4 73.7,18.15 C23.2 | 65.3,20.75 65.4,20.75 65.4,21.3 64.3,21.3 64.3,21.4 64.2,21.4 64.2,22.7 65.2,22.7 65.2,23.2 68.3,23.2 69.5,22 v71.15,22 72.35,22 | 93.8,24.6 93.8,24.8 94.2,25.2 | v91.1,21.9 89.6,23.4 89.6,23.6 89.2,24 89.2,24.6 87.6,26.2 87.6,26.4 89.2,28 89.2,30 89.4,29.8 v89.4,29 88.2,29 86.4,27.2 v79.6,27.4 | C18.- 25.36,14.16 | JP1.6 39,34.8 37.35,33.15 38.4,32.1 38.6,32.1 38.1,31.6 38.1,30.4 38,30.3 v37.2,30.3 | v26,18.9 25.9,17.9 25.8,17.8 | 11.25,20.25 10.9,19.9 | R5.1 11.3,20.2 11.25,20.25 | v20.2,32.2 35.3,32.2 v37.2,30.3 | v42.3,30.1 37.4,30.1 v37.2,30.3
  Bottom 0.305: 39.6,27.1 38.9,26.8 38.9,26.95 v35.65,26.55 | 39.6,27.1 42.04,26.93 | 42.04,26.93 43.8,26.8 | 14.42,21.52 U2.11 | U2.10 14.08,21.52 v14.4,21.2 | 68.9,17.2 69.1,17.4 70.2,17.4 v71.15,18.4 | R10.1 20.55,15.05 21.5,14.1 23.07,14.1 C18.- | 74.2,35.6 v74,35.6 | v74,35.6 73.4,35.6 | 73.4,35.6 67.5,35.6 S2.2 | U5.6 65.3,20.75 | v74,35.6 76.56,35.6 S2.1 | 71,33.2 73.4,35.6 | 25.6,17.8 25.67,17.73 25.73,17.73 25.8,17.8 | 39.6,27.1 35.8,26.8 v35.65,26.55 | v35.65,26.55 27.85,26.95 v27.3,26.6 | v42,25 42,26.89 42.04,26.93
  Bottom 0.406: U5.7 64.4,21.25 | v27.3,21.45 28.8,21.2 29.7,22.1 32.9,22.1 34.4,20.6 34.4,18.7 33,17.3 | 32.3,17.3 32.1,17.1 | 29,17.1 28.9,17.2 28.9,17.6 29,17.7 | 27.71,17.7 C13.2 | v12.2,1.4 v21.2,1.4 v30.2,1.4 v39.2,1.4 v48.2,1.4 v57.2,1.4 v66.2,1.4 v75.2,1.4 v84.2,1.4 v93.4,1.4 93.8,1.4 94,1.2
  Bottom 0.61: v93.4,1.4 93,3 92.8,3.2 92.8,4
  other vias: 14.4,19.9 71.15,20.2 27.3,23.25 93.7,20.7 93.7,21.9 72.4,22
  pour Bottom (isolate 0.305): 0,37.02 98.6,37.02 98.6,0 0,0
MISO-D12  (via drill 0.6)
  Top 0.254: U8.5 92.6,16.85 93.65,15.8 v94.2,15.8
  Top 0.305: U8.5 | v90.9,32.2 88.12,32.2 JP2.P$6 | v50.4,17 50.4,17.62 U1.16
  Bottom 0.254: 86.6,31 86.6,29 67.6,29 67.4,28.8
  Bottom 0.305: 67.4,28.8 54.6,16 50.8,16 50.4,16.4 v50.4,17 | 86.6,31 86.6,33.72 JP2.P$6
  Bottom 0.406: v90.9,32.2 90.9,24.1 92.6,22.5 92.6,16.8 93.6,15.8 v94.2,15.8
MOSI-D11  (via drill 0.6)
  Top 0.254: 50.52,18.82 50.42,18.82 49,17.4 v49,17
  Top 0.305: X4.1 62.25,23.4 62.3,23.45 | U8.3 91.61,16.61 91.6,16.6 90.2,16.6 | 84.3,22.7 84.3,22.5 90.2,16.6 | 90.2,16.6 v90.8,16
  Top 0.406: U1.15 50.52,18.82 | U4.5 68.76,23.9 64.5,23.9 64.5,24 v64.3,23.9 62.75,23.9 62.3,23.45 | v84.15,22.6 84.3,22.7 83.7,23.3 83.7,31.54 JP2.P$3
  Bottom 0.305: v90.8,16 90.8,8.2 92.6,6.4 94.24,6.4 X2.1
  Bottom 0.406: 55.05,15.5 55.08,15.53 | 55.08,15.53 63.6,23.9 v64.3,23.9 64.3,23.8 69.1,23.8 70,22.9 76.2,22.9 76.5,22.6 v84.15,22.6 | v49,17 49,15.8 49.4,15.4 54.95,15.4 55.08,15.53
N$1
  Top 0.305: U1.8 47.12,24.32 46.2,23.4 44.29,23.4 Q1.1
N$2
  Top 0.305: U1.7 47.69,25.01 46.3,26.4 44.29,26.4 Q1.3
N$3  (via drill 0.6)
  Top 0.305: v66.9,26.9 64,26.9 v63.4,27.5 | U4.24 76.97,23.93 v77.3,23.6
  Top 0.406: v17.5,28.15 17.1,27.85 17.1,23.8 18.9,23.8 19.4,24 23.6,24 U3.5
  Bottom 0.406: v66.9,26.9 70.2,23.6 v77.3,23.6 | v17.5,28.15 58.6,28.15 60.3,29.85 61.4,29.85 63.4,27.85 v63.4,27.5
N$4  (via drill 0.6)
  Top 0.254: v46.4,14.3 45.5,15.1 42.8,15.1 33.9,24 U3.24
  Top 0.406: U3.24
  Bottom 0.406: v46.4,14.3 46.4,10.2 43.8,7.6 4.6,7.6 3.8,6.8 X1.1
N$5
  Top 0.305: U4.23 76.03,23.27 76.65,22.65 80.18,22.65 TP1.TP
N$6
  Top 0.406: TP2.TP 32.46,23.04 32.33,23.35 U3.23
N$7
  Bottom 0.254: 12.6,16.3 12.75,16.45 12.75,16.5 R4.1 11.9,16.45 | R5.2 11.9,16.45 | U2.7 12.22,20.02 12,19.8 12,16.55 11.9,16.45
N$8
  Bottom 0.305: U2.3 17.4,20.53 17.4,19.6 18.8,19.6
  Bottom 0.406: 18.8,19.6 R6.1 R10.2
N$9
  Top 0.305: U3.27 32.5,25.95 R2.1
N$10
  Bottom 0.254: R4.2 12.8,19.39 U2.6 12.95,17.75 12.9,17.7 13.6,17.7 14.1,17.2 14.1,16 13.4,15.3 6.1,15.3
  Bottom 0.305: 15.8,21.52 15.8,21.7 15.89,21.61 U2.1
  Bottom 0.406: C14.1 6.1,15.3 5.2,16.2 5.2,19.53 | 4.6,19.51 L1.1
  Bottom 0.61: 15.8,21.7 15.8,26.6 8.2,26.6 6.4,28.4 | 6.4,28.4 6.4,30.9 G1.P$1+ | L1.1 4.53,21.78 | 4.53,21.78 4.46,22.06 | 4.6,19.53 L1.1 | 4.53,21.78 4.53,22.03 6.4,23.9 6.4,28.4 | 5.2,19.53 L1.1
N$11
  Bottom 0.305: U2.9 11.96,21.04 11.1,21.9 9.7,21.9 8.4,20.6 8.4,19.83 L1.2
N$12  (via drill 0.6)
  Top 0.254: v25.1,16.5 v27.8,16.5
  Bottom 0.254: U2.4 16.93,20.02 16.93,16.06 20.14,16.06 21.3,16.5 v25.1,16.5 | 34.98,15.78 R9.2 | 31.35,16.6 31.25,16.5 v27.8,16.5
  Bottom 0.406: R9.2 | R9.2 31.35,15.78 31.35,16.6 R7.1
N$13
  Bottom 0.254: U5.2 67.05,18.5 TP3.TP
N$14
  Top 0.254: 91.18,25.88 Q3.2 91.3,25.17 91.61,24.86 U8.14 | C20.1 91.85,27.25 91.18,26.58
  Top 0.305: 91.18,25.88 91.18,26.58
N$15
  Top 0.254: U8.15 91.11,23.69 90.8,24 87.8,24 87.3,24.5 87.3,25.11 Q3.1 87.15,26.02 C19.1
N$16
  Top 0.305: U4.27 77.43,25.88 R11.1
N$17
  Top 0.305: U8.8 94.78,19.42 95.6,18.6 95.6,17.4
  Top 0.406: 95.6,17.4 C21.1
N$18
  Top 0.305: U8.7 93.61,17.39
  Top 0.406: 93.61,17.39 C21.2
N$19
  Top 0.254: U8.10 93.61,23.81 93.8,24 95.6,24
  Top 0.305: INB.TP 95.93,24.33 C26.2
  Top 0.406: 95.6,24 C26.2
N$20
  Top 0.254: U8.13 92.11,26.56 C22.1
N$21
  Top 0.254: U7.6 37.4,31.55 | 37.4,31.55 36.3,31.55 C34.1 | U7.5 37.45,32.05 37.4,32 37.4,31.55
  Top 0.305: C34.1 C29.1
N$22
  Top 0.254: U8.9 94.38,23.22 95.2,22.4
  Top 0.305: INA.TP 95.89,22.11 C26.1
  Top 0.406: 95.2,22.4 C26.1
N$23
  Bottom 0.254: U5.5 64.29,20.24 C31.1
N$25
  Top 0.254: 56.12,25.57 56.12,25.82 60.9,30.6 69.4,30.6 71.2,32.4 76.8,32.4 77.4,31.8 77.4,30.62
  Top 0.305: 56.02,25.57 56.12,25.57 | 77.4,30.62 S1.1
  Top 0.406: U1.27 56.02,25.57
OUT0A
  Top 0.305: 68.76,22.6 U4.7
  Top 0.406: LED5.1 51.8,5.4 49.2,8 49.2,13.4 52,16.3 59.4,16.3 65.8,22.6 68.76,22.6
OUT0B
  Top 0.305: 11.8,15.1 5.6,15.1 4.9,14.4 4.9,7.5 6.8,5.6
  Top 0.406: LED10.1 6.8,5.6 6.8,6 | 11.8,15.1 19.2,22.6 23.58,22.6 U3.7
OUT1A
  Top 0.406: LED5.4 51.8,12.2 55,15.5 59.7,15.5 66.1,22 68.76,22 U4.8
OUT1B
  Top 0.406: LED10.4 6.8,12.2 9,14.4 12,14.4 19.6,22 23.64,22 U3.8
OUT2A
  Top 0.406: LED5.3 55.8,12.2 57.2,14.8 59.9,14.8 66.5,21.4 68.72,21.4 U4.9
OUT2B
  Top 0.406: LED10.3 10.8,12 20.2,21.4 U3.9
OUT3A
  Top 0.406: LED4.1 60.8,5.4 58.7,7.8 58.7,14.1 60.2,14.1 66.7,20.6 68.71,20.6 U4.10
OUT3B
  Top 0.406: LED9.1 15.8,6 13.4,8.4 13.4,13.4 20.8,20.8 23.62,20.8 U3.10
OUT4A
  Top 0.406: LED4.4 60.3,13.1 67.1,20 68.77,20 U4.11
OUT4B
  Top 0.305: U3.11 23.51,20.08 23.49,20.1
  Top 0.406: LED9.4 15.8,14.2 21.5,20.1 23.49,20.1
OUT5A
  Top 0.406: LED4.3 64.8,16.5 67.5,19.4 68.77,19.4 U4.12
OUT5B
  Top 0.406: LED9.3 19.8,17.2 22,19.4 23.63,19.4 U3.12
OUT6A
  Top 0.406: LED3.1 69.8,5.6 67.7,8 67.7,18.75 68.71,18.75 U4.13
OUT6B
  Top 0.406: LED8.1 24.8,5.8 22.4,8.2 22.4,18.8 23.67,18.8 U3.13
OUT7A
  Top 0.406: LED3.4 69.8,15.8 68.8,16.8 U4.14
OUT7B
  Top 0.406: LED8.4 24.8,15 23.8,16 23.8,18.03 U3.14
OUT8A
  Top 0.406: LED3.3 73.8,15.6 74.8,16.6 74.8,18.02 U4.15
OUT8B
  Top 0.406: LED8.3 28.8,16 29.6,16.8 29.6,18.13 U3.15
OUT9A
  Top 0.406: LED2.1 78.8,5.6 76.2,8.2 76.2,18.8 74.81,18.8 U4.16
OUT9B
  Top 0.406: LED7.1 33.8,5.8 31.4,8.2 31.4,18.8 29.63,18.8 U3.16
OUT10A
  Top 0.406: LED2.4 78.8,12.4 78,13.2 78,18 76.6,19.4 74.75,19.4 U4.17
OUT10B
  Top 0.305: U3.17 29.67,19.4
  Top 0.406: LED7.4 33.8,17.2 31.6,19.4 29.67,19.4
OUT11A
  Top 0.406: LED2.3 82.8,14.6 77.4,20 74.75,20 U4.18
OUT11B
  Top 0.305: U3.18 29.71,20
  Top 0.406: LED7.3 37.8,14.2 32,20 29.71,20
OUT12A
  Top 0.406: LED1.1 87.8,5.8 85.2,8.4 85.2,13.8 78.2,20.7 74.86,20.7 U4.19
OUT12B
  Top 0.406: LED6.1 42.8,5.8 40.4,8.2 40.4,13.4 33.2,20.6 29.77,20.6 U3.19
OUT13A
  Top 0.305: 74.8,21.35 74.75,21.35 U4.20
  Top 0.406: LED1.4 87.6,12.4 78.6,21.35 74.8,21.35
OUT13B
  Top 0.406: LED6.4 42.8,12.2 33.6,21.4 U3.20
OUT14A
  Top 0.406: LED1.3 91.8,12 89.4,14.4 86.8,14.4 79,21.95 74.96,21.95 U4.21
OUT14B
  Top 0.406: LED6.3 46.8,12 44.6,14.1 42,14.1 34.2,21.98 29.78,21.98 U3.21
RESET  (via drill 0.6)
  Top 0.254: U1.29 54.94,26.64 55.6,27.3 57,27.3 61.3,31.6 64.85,31.6 C15.2 R8.1 68.65,31.55 v69.2,32.1
  Top 0.406: U1.29
  Bottom 0.305: v69.2,32.1 68.18,31.08 S2.4 67.48,30.92 68.2,30.2 75.7,30.2 S2.3 76.58,31.82 JP2.P$2
RXI  (via drill 0.6)
  Top 0.254: 54.4,27.2 54.5,27.2 54.5,27.5 56.6,29.6 | U7.21 40.25,35.85 40.4,36 45.2,36 45.8,35.4 v45.8,33.8 | 59.8,34.96 JP1.3
  Top 0.305: 56.6,29.6 56.6,31.8 57.4,32.6 59.4,32.6 59.8,33 59.8,34.76 JP1.3
  Top 0.406: U1.30 54.4,27.2
  Bottom 0.254: JP1.3 59.8,34.96 59.8,34.4 58.8,33.4 48.6,33.4 48.2,33.8 v45.8,33.8
SCK-D13  (via drill 0.6)
  Top 0.254: 68.77,24.6 67.6,24.6 67.25,24.75 60.88,24.75 X4.2 | v45,16.2 51.09,16.2 U1.17 53.9,17.6 v54.4,17.6 | 90.59,19.4 U8.1 v89.4,19.42 88.98,19.42 84.6,23.8 84.6,31.4 83.8,32.2 83.8,33.98 JP2.P$4
  Top 0.305: U3.4 18.14,24.66 v18,24.8 | v38.5,20.7 42.8,16.4 44.8,16.4 v45,16.2
  Top 0.406: 68.77,24.6 U4.4
  Bottom 0.254: v45,16.2 37.8,9 X1.2 | X2.2 92.8,9 91.8,10 91.8,18.23 U8.1 v89.4,19.42 | JP2.P$4 81.64,35.24 81.2,34.8 81.2,30 80.8,29.6 67.65,29.6 | X4.2 60.67,24.67 59.2,23.2 59.2,22.4 v54.4,17.6
  Bottom 0.305: v18,24.8 18,24.4 18.2,24.2 35,24.2 v38.5,20.7 | 67.65,29.6 67.05,29.6 62.2,24.75 60.88,24.75 X4.2
TXO  (via drill 0.6)
  Top 0.254: U1.31 53.97,27.77 54.6,28.4 v54.6,32.2 | U7.20 40.75,35.35 40.8,35.4 44.6,35.4 45,35 v45,32.2
  Top 0.406: U1.31
  Bottom 0.254: JP1.2 60.18,32.8 56.6,32.8 56,32.2 54.7,32.2 | v45,32.2 v54.6,32.2 | v54.6,32.2 54.7,32.2 | v54.6,32.2 54.6,32.1 54.7,32.2
V+
  Top 0.254: X3.P1-VCC 5.1,16.3 5.9,16.3 8,18.4 8,28.7 12.3,33 22.6,33 | U7.8 39.25,30.45 39.2,30.4 38.8,30.4 38.8,30.85 U7.7 | 22.6,33 29.8,33 32,30.8 32,29.4 32.2,29.2 C27.1 | D1.C 22.6,33
  Top 0.305: X3.P1-VCC 7.5,16.1 D4.A | C27.1 U7.7
YOUT  (via drill 0.6)
  Top 0.254: U1.25 57.27,24.38 57.9,25 58,25 61.9,21.1 62.2,21.1 v62.3,21.2
  Bottom 0.254: U5.4 66.04,18.21 C30.1 66,18.15 66,17.5 65.6,17.1 64.1,17.1 62.3,18.9 v62.3,21.2
ZOUT
  Bottom 0.254: U5.16 69.59,20.24 C28.1

### Text on the board
Bottom: Open-source POV light
tPlace: BLK | GRN | GND | VCC | TXO | RXI | Released under the Creative Commons Attribution Share-Alike 3.0 License | http://creativecommons.org/licenses/by-sa/3.0
tNames: Open POV r10 | C Larsen 2014